# EAGLE design Schematics_backup2 (EAGLE 9.2.2)
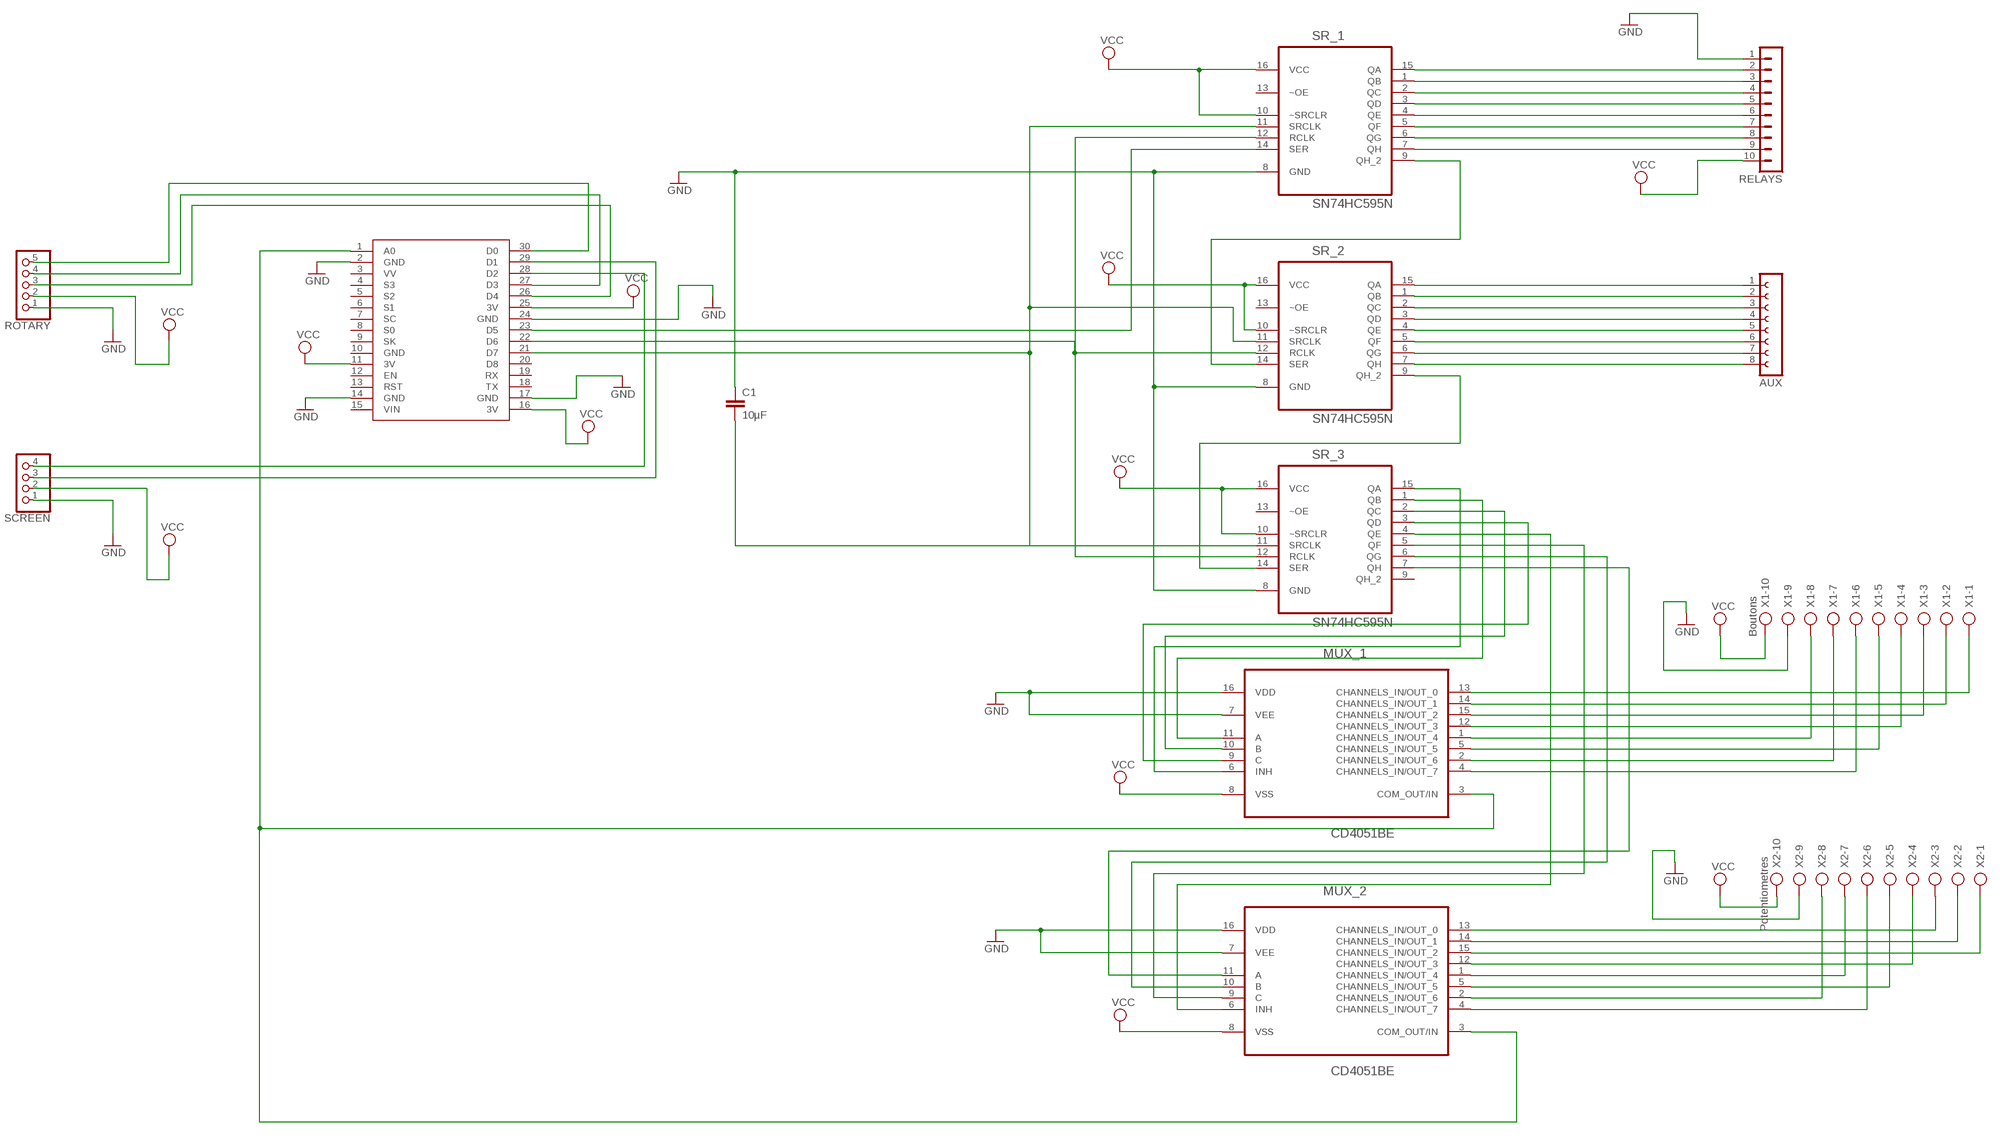
[diagram p0: schematic, sheet 1]

## Parts
AUX  FE08-1  [FE08]
C1  10µF  C2,5-3  [C2.5-3]
MUX_1  CD4051BE  [DIP254P762X508-16]
MUX_2  CD4051BE  [DIP254P762X508-16]
RELAYS  MA10-1W  [MA10-1W]
ROTARY  PINHD-1X5  [1X05]
SCREEN  PINHD-1X4  [1X04]
SR_1  SN74HC595N  [DIP254P762X508-16]
SR_2  SN74HC595N  [DIP254P762X508-16]
SR_3  SN74HC595N  [DIP254P762X508-16]
U$1  NODEMCU  [NODEMCU]
X1  Boutons  AK300/10  [AK300/10]
X2  Potentiometres  AK300/10  [AK300/10]

## Nets
GND: C1.1 MUX_1.7(VEE) MUX_1.16(VDD) MUX_2.7(VEE) MUX_2.16(VDD) RELAYS.1 ROTARY.1 SCREEN.1 SR_1.8(GND) SR_2.8(GND) SR_3.8(GND) U$1.2(GND) U$1.14(GND) U$1.17(GND) U$1.24(GND) X1.9 X2.9
N$1: RELAYS.2 SR_1.15(QA)
N$2: SR_1.14(SER) U$1.23(D5)
N$3: SR_1.12(RCLK) SR_2.12(RCLK) SR_3.12(RCLK) U$1.22(D6)
N$4: SR_2.9(QH_2) SR_3.14(SER)
N$5: C1.2 SR_1.11(SRCLK) SR_2.11(SRCLK) SR_3.11(SRCLK) U$1.21(D7)
N$6: RELAYS.3 SR_1.1(QB)
N$7: RELAYS.4 SR_1.2(QC)
N$8: RELAYS.5 SR_1.3(QD)
N$9: RELAYS.6 SR_1.4(QE)
N$10: RELAYS.7 SR_1.5(QF)
N$11: RELAYS.8 SR_1.6(QG)
N$12: RELAYS.9 SR_1.7(QH)
N$13: MUX_1.13(CHANNELS_IN/OUT_0) X1.1
N$14: MUX_1.14(CHANNELS_IN/OUT_1) X1.2
N$15: SR_1.9(QH_2) SR_2.14(SER)
N$16: MUX_1.15(CHANNELS_IN/OUT_2) X1.3
N$17: MUX_1.12(CHANNELS_IN/OUT_3) X1.4
N$18: MUX_1.1(CHANNELS_IN/OUT_4) X1.8
N$19: MUX_1.5(CHANNELS_IN/OUT_5) X1.5
N$20: MUX_1.2(CHANNELS_IN/OUT_6) X1.7
N$21: MUX_1.4(CHANNELS_IN/OUT_7) X1.6
N$22: MUX_2.1(CHANNELS_IN/OUT_4) X2.7
N$23: MUX_2.2(CHANNELS_IN/OUT_6) X2.8
N$24: MUX_1.6(INH) SR_3.15(QA)
N$25: MUX_1.11(A) SR_3.1(QB)
N$26: MUX_1.10(B) SR_3.2(QC)
N$27: MUX_1.9(C) SR_3.3(QD)
N$28: MUX_2.6(INH) SR_3.4(QE)
N$29: MUX_2.9(C) SR_3.5(QF)
N$30: MUX_2.10(B) SR_3.6(QG)
N$31: MUX_2.11(A) SR_3.7(QH)
N$32: MUX_1.3(COM_OUT/IN) MUX_2.3(COM_OUT/IN) U$1.1(A0)
N$33: MUX_2.4(CHANNELS_IN/OUT_7) X2.6
N$34: MUX_2.5(CHANNELS_IN/OUT_5) X2.5
N$35: MUX_2.12(CHANNELS_IN/OUT_3) X2.4
N$36: MUX_2.15(CHANNELS_IN/OUT_2) X2.1
N$37: MUX_2.14(CHANNELS_IN/OUT_1) X2.2
N$38: MUX_2.13(CHANNELS_IN/OUT_0) X2.3
N$39: AUX.1 SR_2.15(QA)
N$40: AUX.2 SR_2.1(QB)
N$41: AUX.3 SR_2.2(QC)
N$42: AUX.4 SR_2.3(QD)
N$43: AUX.5 SR_2.4(QE)
N$44: AUX.6 SR_2.5(QF)
N$45: AUX.7 SR_2.6(QG)
N$46: AUX.8 SR_2.7(QH)
N$48: ROTARY.3 U$1.26(D4)
N$49: ROTARY.5 U$1.30(D0)
N$50: ROTARY.4 U$1.27(D3)
N$51: SCREEN.4 U$1.28(D2)
N$52: SCREEN.3 U$1.29(D1)
VCC: MUX_1.8(VSS) MUX_2.8(VSS) RELAYS.10 ROTARY.2 SCREEN.2 SR_1.10(~SRCLR) SR_1.16(VCC) SR_2.10(~SRCLR) SR_2.16(VCC) SR_3.10(~SRCLR) SR_3.16(VCC) U$1.11(3V) U$1.16(3V) U$1.25(3V) X1.10 X2.10
Unconnected: SR_1.13(~OE) SR_2.13(~OE) SR_3.9(QH_2) SR_3.13(~OE) U$1.3(VV) U$1.4(S3) U$1.5(S2) U$1.6(S1) U$1.7(SC) U$1.8(S0) U$1.9(SK) U$1.12(EN) U$1.13(RST) U$1.15(VIN) U$1.18(TX) U$1.19(RX) U$1.20(D8)

## Power pins joined to a net without a drawn wire
GND: U$1.10(GND)

## Library data of the parts
AUX = con-lsta:FE08-1: FEMALE HEADER; OC_FARNELL: unknown; OC_NEWARK: unknown
C1 = capacitor-wima:C: CAPACITOR naming: grid - package width
MUX_1 MUX_2 = CD4051BEE4:CD4051BE: The CD4051B is a single 8-Channel multiplexer having three binary control inputs.; MPN: CD4051BE; OC_FARNELL: 2135100; OC_NEWARK: 60K5119; PACKAGE: PDIP-16; SUPPLIER: Texas Instruments
RELAYS = con-lstb:MA10-1W: PIN HEADER; OC_FARNELL: unknown; OC_NEWARK: unknown
ROTARY = pinhead:PINHD-1X5: PIN HEADER
SCREEN = pinhead:PINHD-1X4: PIN HEADER
SR_1-SR_3 = 74hc595:SN74HC595N: 8-BIT SHIFT REGISTERS WITH 3-STATE OUTPUT REGISTERS; MPN: SN74HC595N; OC_FARNELL: 9591664; OC_NEWARK: 60K6845; PACKAGE: PDIP-16; SUPPLIER: Texas Instruments
U$1 = nodemcu:NODEMCU
X1 X2 = con-ptr500:AK300/10: CONNECTOR; OC_FARNELL: unknown; OC_NEWARK: unknown

## Board
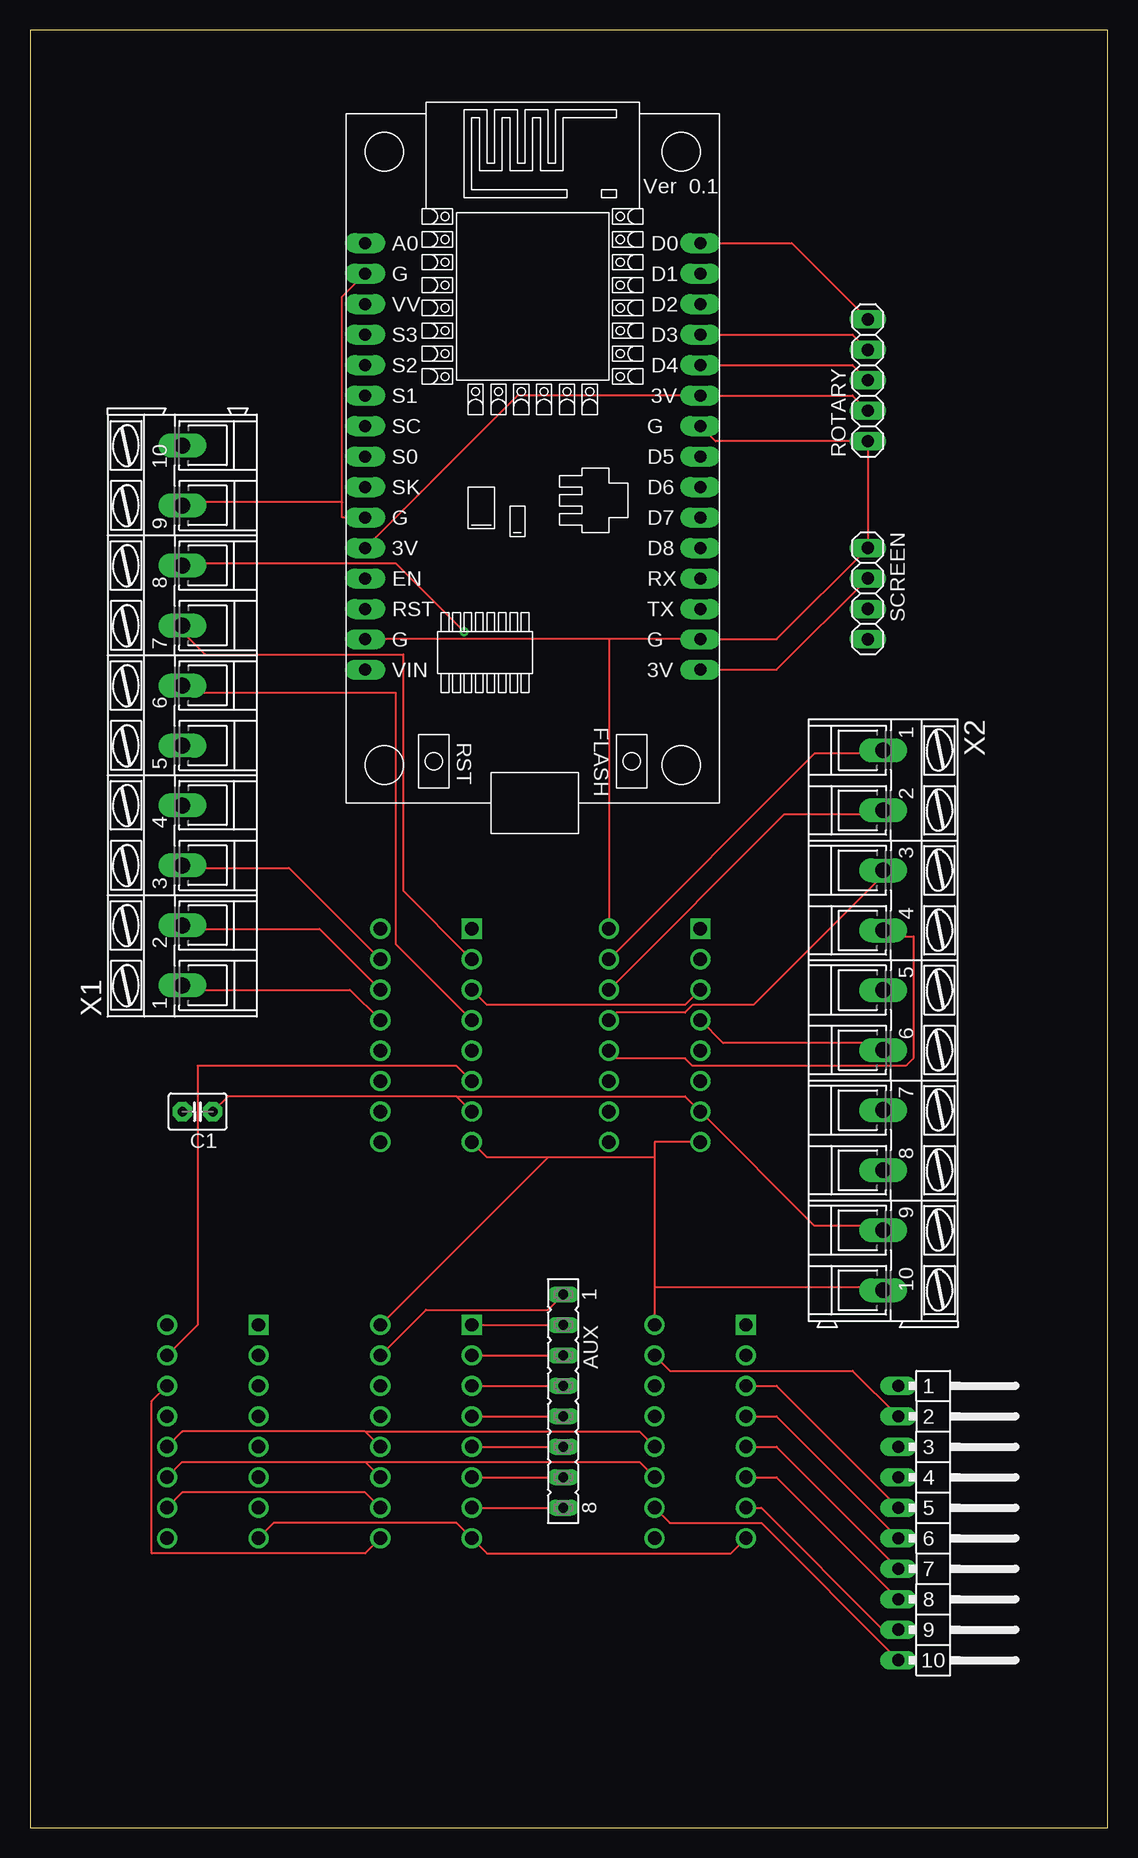
[diagram p1: board, top side]
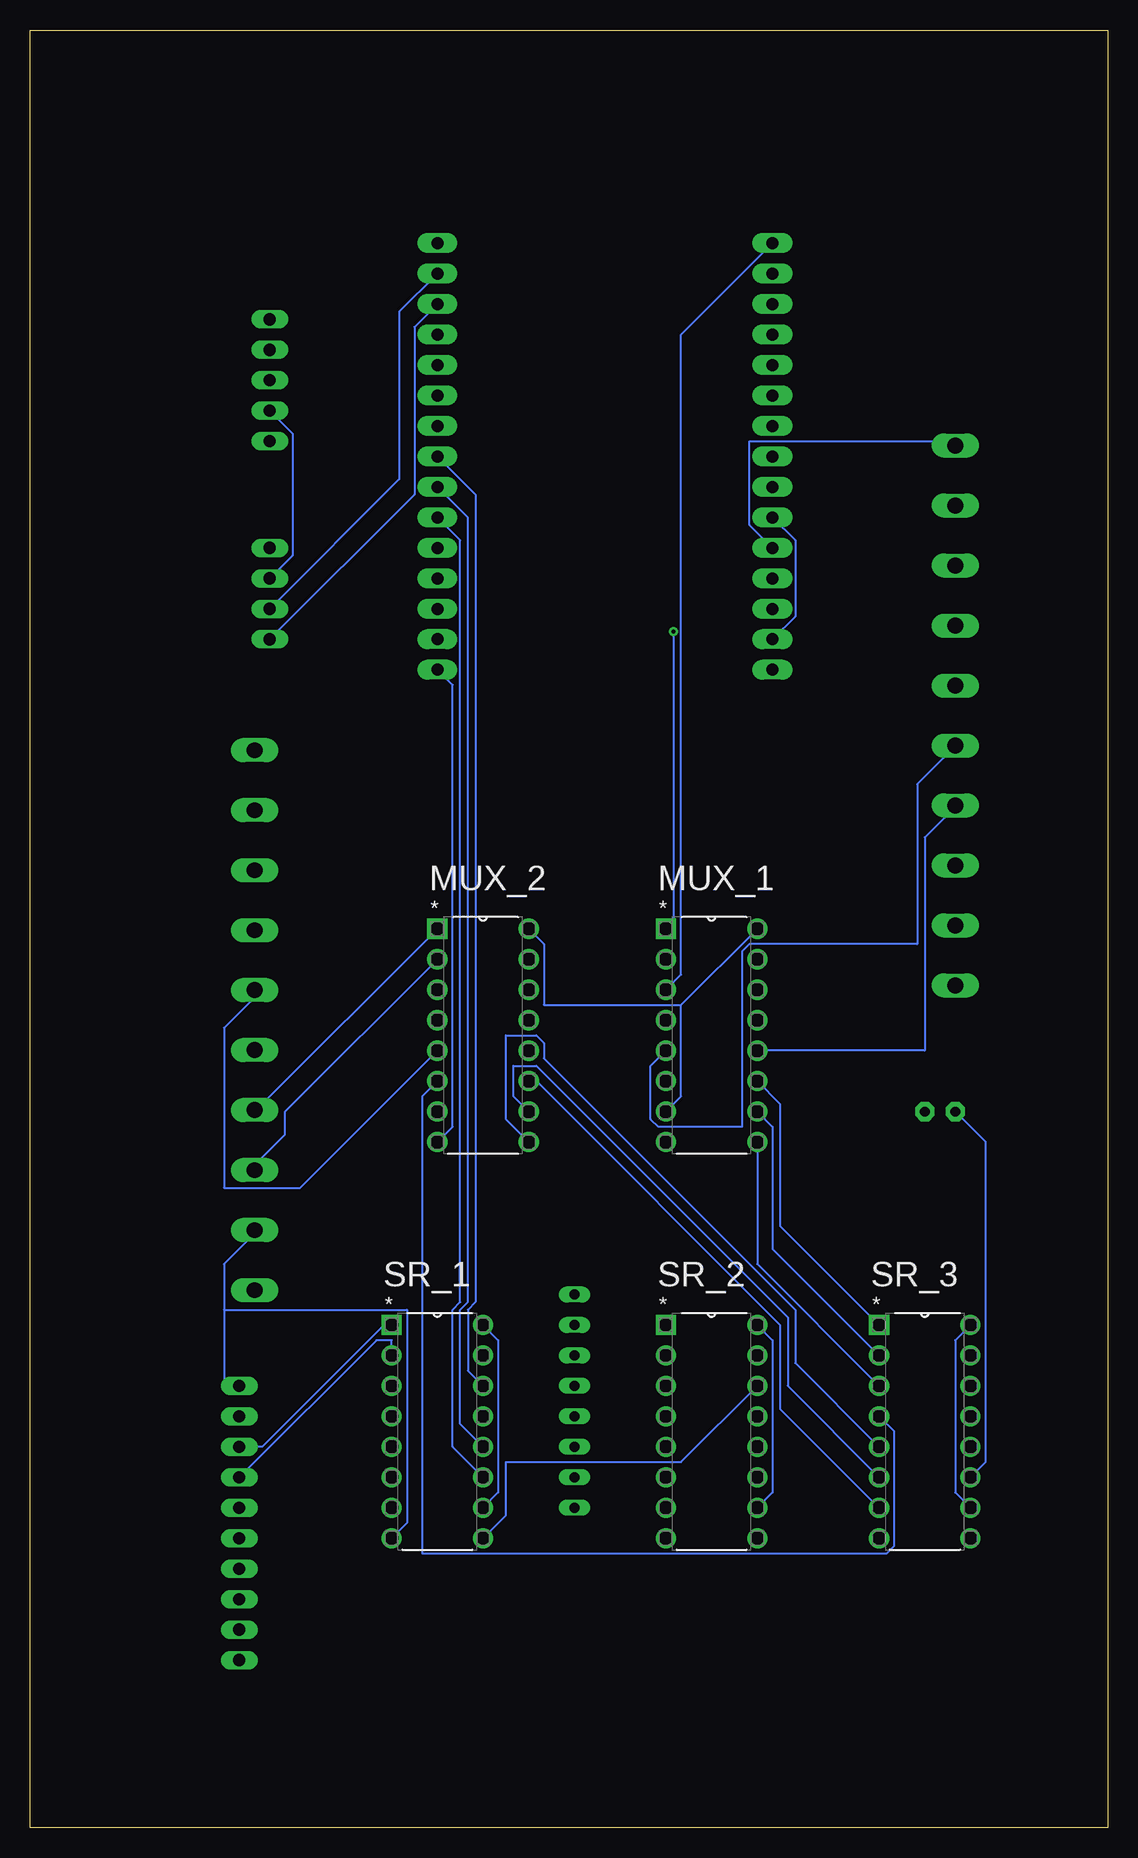
[diagram p2: board, bottom side, seen from below]

Size 89.84 x 149.85 mm. Coordinates in mm from the lower left corner, seen from the top.
Outline: 0,0 89.84,0 89.84,149.85 0,149.85 0,0
Copper layers (1*16): Top 0.035mm / dielectric 1.5mm / Bottom 0.035mm
Design rules "default": minimum track width 6mil, minimum drill 0.35mm, track to track 6mil, track to pad 6mil, pad to pad 6mil, via to via 6mil, smd to smd 6mil, copper to edge 40mil, drill to drill 6mil, minimum pad ring 10mil, minimum via ring 8mil, stop-mask expansion 4mil, vias tented up to drill 0mil, thermal gap 10mil

### Footprints (pad centres in the part's own frame; a part is rotated, then mirrored left to right if it is on the bottom)
FE08 = drill 0.813 long: 1 -8.89,0; 2 -6.35,0; 3 -3.81,0; 4 -1.27,0; 5 1.27,0; 6 3.81,0; 7 6.35,0; 8 8.89,0
C2.5-3 = drill 0.813 pad 1.6 octagon: 1 -1.27,0; 2 1.27,0
DIP254P762X508-16 = drill 1.118 square: 1 -7.62,17.78 | drill 1.118: 2 -7.62,15.24; 3 -7.62,12.7; 4 -7.62,10.16; 5 -7.62,7.62; 6 -7.62,5.08; 7 -7.62,2.54; 8 -7.62,0; 9 0,0; 10 0,2.54; 11 0,5.08; 12 0,7.62; 13 0,10.16; 14 0,12.7; 15 0,15.24; 16 0,17.78
MA10-1W = drill 1.016 long: 1 -11.43,0; 2 -8.89,0; 3 -6.35,0; 4 -3.81,0; 5 -1.27,0; 6 1.27,0; 7 3.81,0; 8 6.35,0; 9 8.89,0; 10 11.43,0
1X05 = drill 1.016 long: 1 -5.08,0; 2 -2.54,0; 3 0,0; 4 2.54,0; 5 5.08,0
1X04 = drill 1.016 long: 1 -3.81,0; 2 -1.27,0; 3 1.27,0; 4 3.81,0
NODEMCU = drill 1 pad 1.676 long: 1 -13.97,17.78; 2 -13.97,15.24; 3 -13.97,12.7; 4 -13.97,10.16; 5 -13.97,7.62; 6 -13.97,5.08; 7 -13.97,2.54; 8 -13.97,0; 9 -13.97,-2.54; 10 -13.97,-5.08; 11 -13.97,-7.62; 12 -13.97,-10.16; 13 -13.97,-12.7; 14 -13.97,-15.24; 15 -13.97,-17.78; 16 13.97,-17.78; 17 13.97,-15.24; 18 13.97,-12.7; 19 13.97,-10.16; 20 13.97,-7.62; 21 13.97,-5.08; 22 13.97,-2.54; 23 13.97,0; 24 13.97,2.54; 25 13.97,5.08; 26 13.97,7.62; 27 13.97,10.16; 28 13.97,12.7; 29 13.97,15.24; 30 13.97,17.78
AK300/10 = drill 1.321 long: 1 -22.504,0; 2 -17.501,0; 3 -12.497,0; 4 -7.493,0; 5 -2.515,0; 6 2.489,0; 7 7.493,0; 8 12.497,0; 9 17.501,0; 10 22.504,0

### Placement (x,y rotation side)
AUX  44.45,35.56 270 top
C1  13.97,59.69 180 top
MUX_1  29.21,57.15 0 bottom
MUX_2  48.26,57.15 0 bottom
RELAYS  72.39,25.4 270 top
ROTARY  69.85,120.65 90 top
SCREEN  69.85,102.87 270 top
SR_1  52.07,24.13 0 bottom
SR_2  29.21,24.13 0 bottom
SR_3  11.43,24.13 0 bottom
U$1  41.91,114.3 0 top
X1  12.7,92.71 90 top
X2  71.12,67.31 270 top

### Tracks (layer width: path | path; a pad name or v marks a point on that pad's centre or on a via)
GND
  Top 0.152: SR_3.8 20.32,25.4 35.56,25.4 SR_2.8 38.1,22.86 58.42,22.86 SR_1.8 | X2.9 71.12,50.17 65.41,50.17 MUX_2.7 54.61,60.96 35.56,60.96 | C1.1 16.51,60.96 35.56,60.96 | MUX_1.7 35.56,60.96 | U$1.2 26.04,127.64 26.04,110.49 | 26.04,110.49 26.04,109.22 U$1.10 | 26.04,110.49 12.7,110.49 X1.9 | U$1.24 57.15,115.57 ROTARY.1 SCREEN.1 62.23,99.06 U$1.17 48.26,99.06 | 48.26,99.06 MUX_2.16 | 48.26,99.06 U$1.14
  Bottom 0.152: 73.66,43.18 73.66,46.99 71.12,49.53 X2.9 | 73.66,43.18 73.66,36.83 RELAYS.1 | 35.56,68.58 MUX_1.16 | 35.56,68.58 35.56,60.96 MUX_1.7 | SR_1.8 58.42,25.4 58.42,43.18 73.66,43.18 | U$1.14 26.04,100.97 26.04,107.31 U$1.10 | 35.56,68.58 46.99,68.58 46.99,73.66 MUX_2.16
N$1
  Top 0.152: RELAYS.2 68.58,38.1 53.34,38.1 SR_1.15
N$2
  Bottom 0.152: SR_1.14 53.34,38.1 53.34,43.18 52.7,43.81 52.7,111.12 U$1.23
N$3
  Top 0.152: SR_3.12 12.7,33.02 27.94,33.02 | SR_2.12 27.94,33.02 | SR_1.12 50.8,33.02 27.94,33.02
  Bottom 0.152: U$1.22 53.34,109.22 53.34,43.81 53.97,43.18 53.97,33.66 SR_1.12
N$4
  Top 0.152: SR_3.14 10.16,35.56 10.16,22.86 27.94,22.86 SR_2.9
N$5
  Top 0.152: 27.94,30.48 SR_2.11 | 27.94,30.48 12.7,30.48 SR_3.11 | SR_1.11 50.8,30.48 27.94,30.48
  Bottom 0.152: C1.2 10.16,57.15 10.16,30.48 SR_3.11 | U$1.21 53.97,107.31 53.97,43.81 54.61,43.18 54.61,31.75 SR_1.11
N$6
  Bottom 0.152: RELAYS.3 70.48,31.75 60.33,41.91 SR_1.1
N$7
  Bottom 0.152: RELAYS.4 60.96,40.64 59.69,40.64 SR_1.2
N$8
  Top 0.152: RELAYS.5 62.23,36.83 SR_1.3
N$9
  Top 0.152: RELAYS.6 62.23,34.29 SR_1.4
N$10
  Top 0.152: RELAYS.7 62.23,31.75 SR_1.5
N$11
  Top 0.152: RELAYS.8 62.23,29.21 SR_1.6
N$12
  Top 0.152: SR_1.7 60.96,26.67 71.12,16.51 RELAYS.9
N$13
  Top 0.152: MUX_1.13 26.67,69.85 12.7,69.85 X1.1
N$14
  Top 0.152: MUX_1.14 24.13,74.93 12.7,74.93 X1.2
N$15
  Bottom 0.152: SR_2.14 35.56,30.48 50.17,30.48 50.17,26.04 SR_1.9
N$16
  Top 0.152: MUX_1.15 21.59,80.01 12.7,80.01 X1.3
N$17
  Bottom 0.152: MUX_1.12 15.24,64.77 15.24,82.55 12.7,85.09 X1.4
N$18  (via drill 0.35)
  Top 0.152: v36.2,99.7 30.48,105.41 12.7,105.41 X1.8
  Bottom 0.152: MUX_1.1 36.2,75.56 v36.2,99.7
N$19
  Bottom 0.152: MUX_1.5 38.1,63.5 38.1,59.05 37.47,58.42 30.48,58.42 30.48,73.03 29.84,73.66 15.88,73.66 15.88,87 12.7,90.17 X1.5
N$20
  Top 0.152: MUX_1.2 31.11,78.11 31.11,97.79 14.61,97.79 12.7,99.7 X1.7
N$21
  Top 0.152: MUX_1.4 30.48,73.66 30.48,94.62 12.7,94.62 X1.6
N$22
  Bottom 0.152: MUX_2.1 71.12,59.69 X2.7
N$23
  Bottom 0.152: MUX_2.2 68.58,59.69 68.58,57.78 71.12,55.25 X2.8
N$24
  Top 0.152: SR_3.15 13.97,41.91 13.97,63.5 35.56,63.5 MUX_1.6
N$25
  Bottom 0.152: SR_3.1 27.3,50.17 27.3,60.33 MUX_1.11
N$26
  Bottom 0.152: SR_3.2 27.94,48.26 27.94,58.42 MUX_1.10
N$27
  Bottom 0.152: SR_3.3 29.21,46.99 MUX_1.9
N$28
  Bottom 0.152: SR_3.4 17.78,33.02 17.78,23.49 18.41,22.86 57.15,22.86 57.15,60.96 MUX_2.6
N$29
  Bottom 0.152: SR_3.5 26.04,38.73 26.04,43.18 46.99,64.14 46.99,65.41 47.62,66.04 50.17,66.04 50.17,59.05 MUX_2.9
N$30
  Bottom 0.152: SR_3.6 26.67,36.83 26.67,42.55 47.62,63.5 49.53,63.5 49.53,60.96 MUX_2.10
N$31
  Bottom 0.152: SR_3.7 27.3,34.92 27.3,41.91 47.62,62.23 MUX_2.11
N$32
  Top 0.152: MUX_1.3 38.1,68.58 54.61,68.58 MUX_2.3
  Bottom 0.152: U$1.1 35.56,124.46 35.56,71.12 MUX_1.3
N$33
  Top 0.152: MUX_2.4 57.78,65.41 71.12,65.41 X2.6
N$34
  Bottom 0.152: MUX_2.5 67.31,53.34 73.66,53.34 73.66,66.67 71.12,69.22 X2.5
N$35
  Top 0.152: 70.99,74.93 X2.4 71.12,74.3 73.66,74.3 73.66,64.14 73.03,63.5 55.25,63.5 54.61,64.14 48.89,64.14 MUX_2.12
N$36
  Top 0.152: MUX_2.15 65.41,89.53 71.12,89.53 X2.1
N$37
  Top 0.152: MUX_2.14 62.86,84.45 71.12,84.45 X2.2
N$38
  Top 0.152: MUX_2.13 48.89,67.94 54.61,67.94 55.25,68.58 60.33,68.58 71.12,79.38 X2.3
N$39
  Top 0.152: AUX.1 43.18,43.18 33.02,43.18 SR_2.15
N$40
  Top 0.152: SR_2.1 AUX.2
N$41
  Top 0.152: SR_2.2 AUX.3
N$42
  Top 0.152: SR_2.3 AUX.4
N$43
  Top 0.152: SR_2.4 AUX.5
N$44
  Top 0.152: SR_2.5 AUX.6
N$45
  Top 0.152: SR_2.6 AUX.7
N$46
  Top 0.152: SR_2.7 AUX.8
N$48
  Top 0.152: ROTARY.3 68.58,121.92 U$1.26
N$49
  Top 0.152: ROTARY.5 63.5,132.08 U$1.30
N$50
  Top 0.152: ROTARY.4 68.58,124.46 U$1.27
N$51
  Bottom 0.152: SCREEN.4 57.78,111.12 57.78,125.09 U$1.28
N$52
  Bottom 0.152: SCREEN.3 59.06,112.39 59.06,126.37 U$1.29
VCC
  Top 0.152: 70.76,44.45 X2.10 71.12,45.08 52.07,45.08 | SCREEN.2 62.23,96.52 U$1.16 | ROTARY.2 68.58,119.38 U$1.25 40.64,119.38 U$1.11 | SR_3.10 12.7,27.94 27.94,27.94 SR_2.10 | RELAYS.10 60.96,25.4 53.34,25.4 SR_1.10 | 52.07,55.88 52.07,57.15 MUX_2.8 | 52.07,55.88 52.07,45.08 | 52.07,45.08 SR_1.16 | MUX_1.8 38.1,55.88 43.18,55.88 | 52.07,55.88 43.18,55.88 | 43.18,55.88 SR_2.16
  Bottom 0.152: U$1.11 29.84,108.59 29.84,115.57 12.7,115.57 X1.10 | SCREEN.2 67.94,106.05 67.94,116.2 ROTARY.2 | SR_3.10 12.7,27.94 12.7,40.64 SR_3.16 | SR_2.10 27.94,27.94 27.94,40.64 SR_2.16 | SR_1.10 50.8,27.94 50.8,40.64 SR_1.16 | U$1.16 54.61,95.25 54.61,58.42 MUX_2.8